# Altium project PDB.PrjPcb
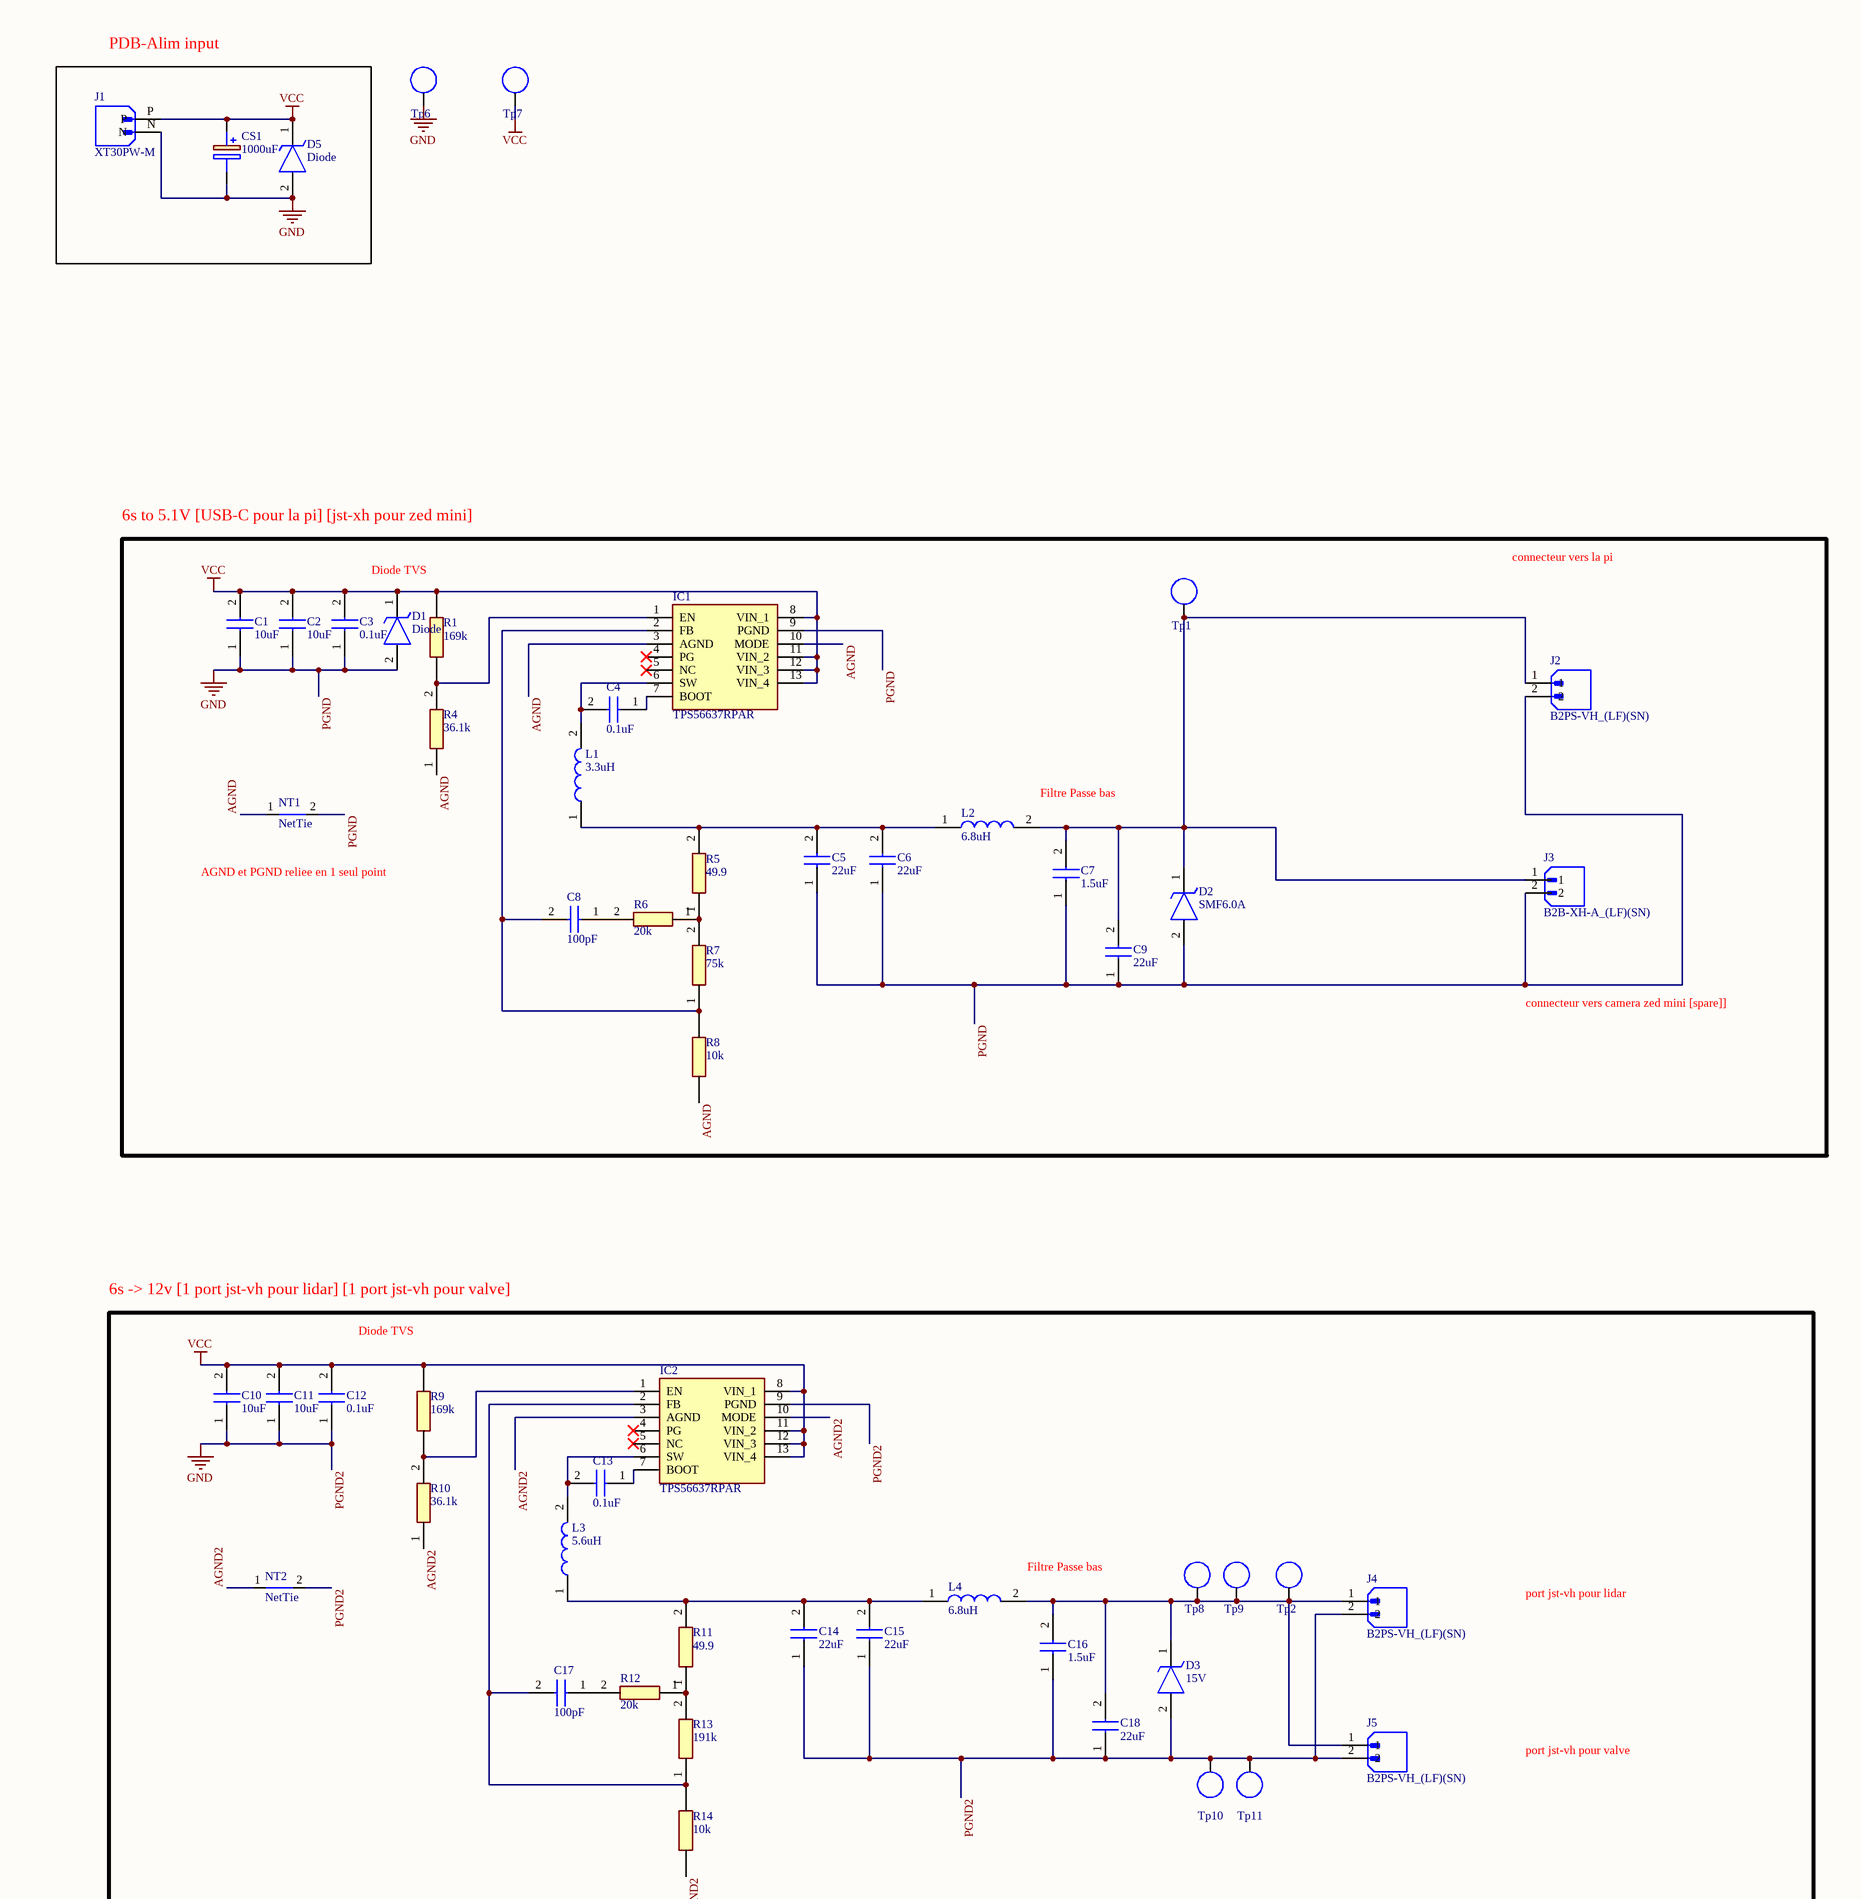
[diagram p0: PDB Schem.SchDoc, top]
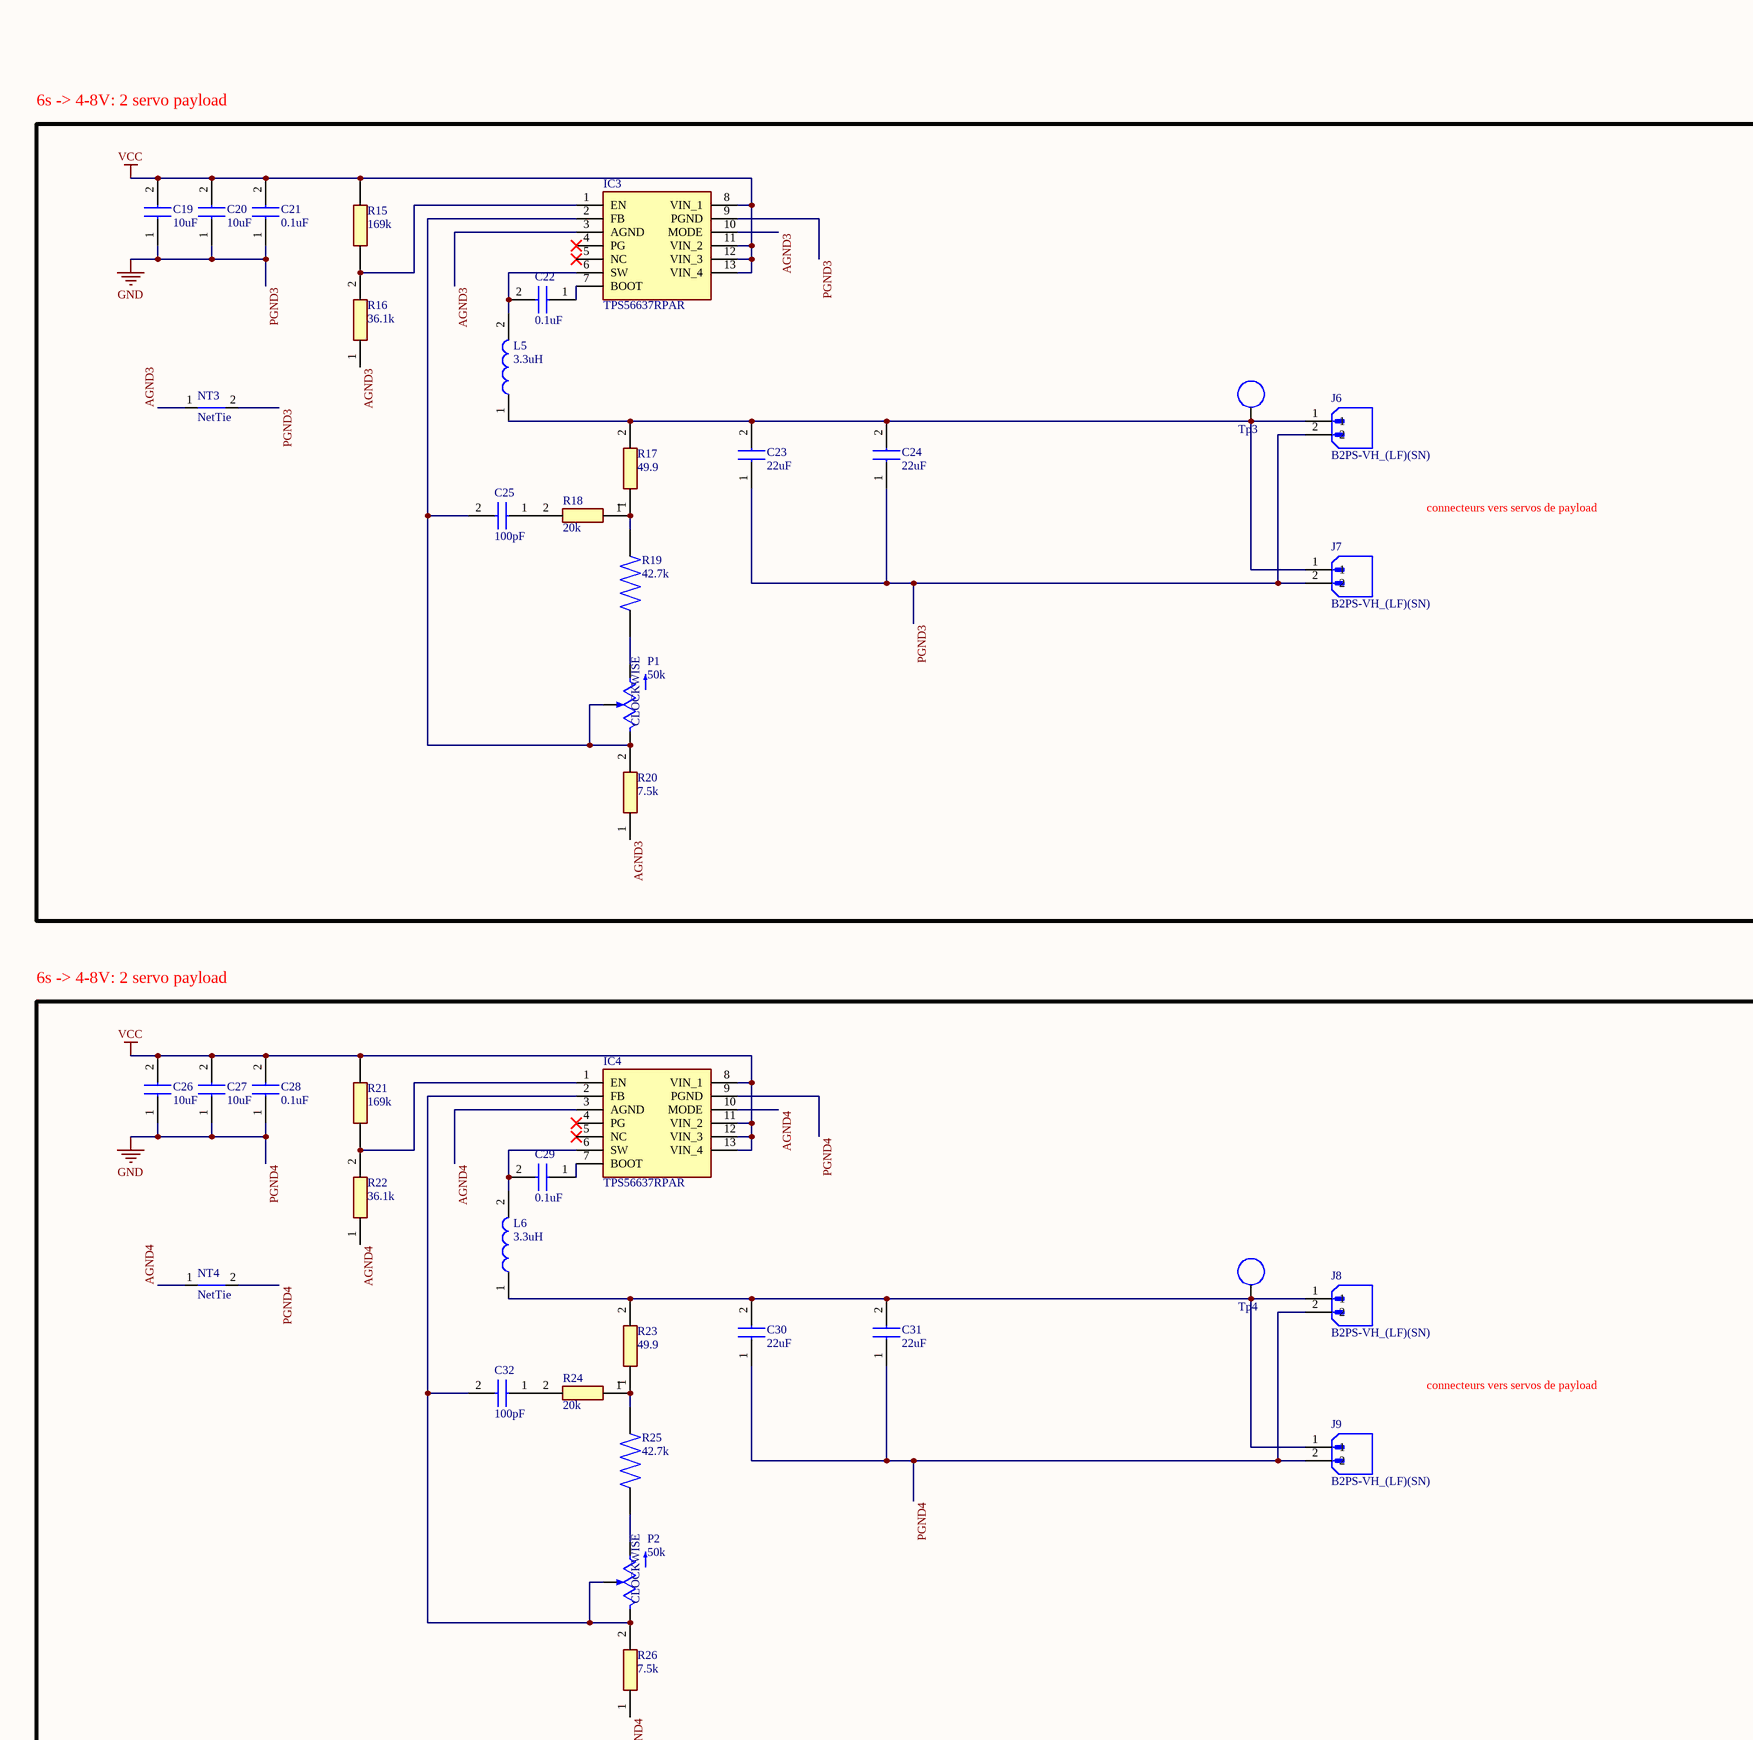
[diagram p1: PDB Schem.SchDoc, centre]
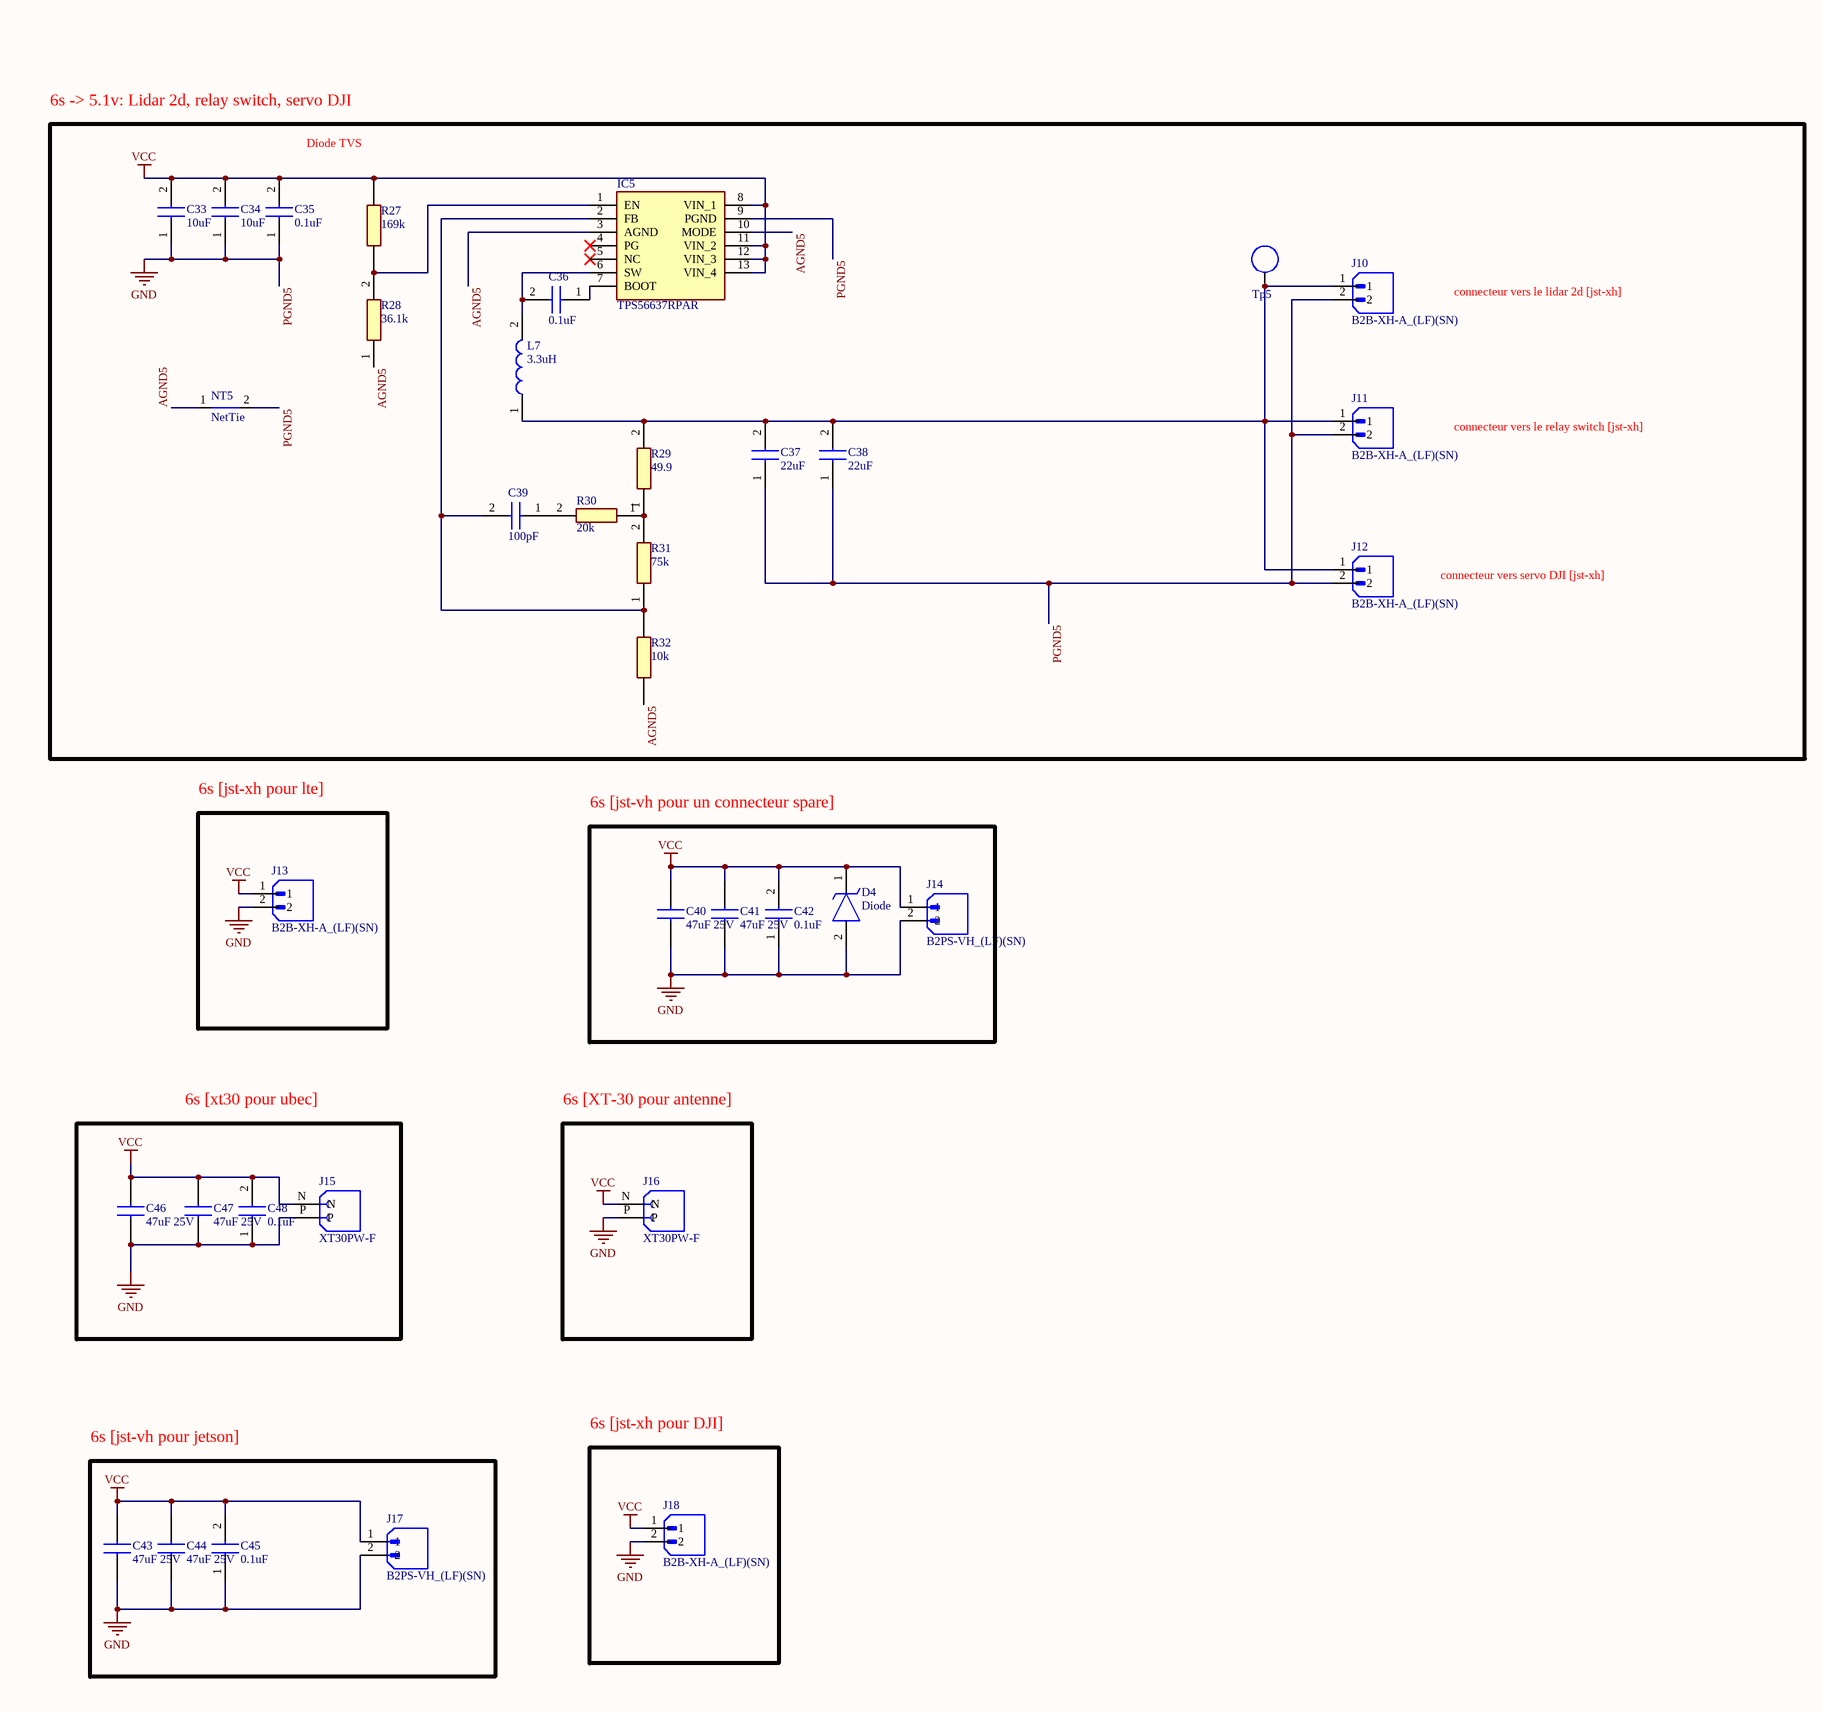
[diagram p2: PDB Schem.SchDoc, bottom]
1 sheet, 132 parts. Net scope: global (net labels, ports and power ports of the same name join across sheets).
Board file: PCB-PDB.PcbDoc

## Sheet PDB Schem.SchDoc
size 999 x 1499 mm; SheetNumber: 1; SheetTotal: 1

### Parts
C1  10uF  [CAPC3225X280N]
C2  10uF  [CAPC3225X280N]
C3  0.1uF  [C0603]
C4  0.1uF  [C0603]
C5  22uF  [CAPC2012X145N]
C6  22uF  [CAPC2012X145N]
C7  1.5uF  [CAPC3225X200N]
C8  100pF  [GRM1885C1H101JA01D]
C9  22uF  [CAPC2012X145N]
C10  10uF  [CAPC3225X280N]
C11  10uF  [CAPC3225X280N]
C12  0.1uF  [C0603]
C13  0.1uF  [C0603]
C14  22uF  [CAPC2012X145N]
C15  22uF  [CAPC2012X145N]
C16  1.5uF  [CAPC3225X200N]
C17  100pF  [GRM1885C1H101JA01D]
C18  22uF  [CAPC2012X145N]
C19  10uF  [CAPC3225X280N]
C20  10uF  [CAPC3225X280N]
C21  0.1uF  [C0603]
C22  0.1uF  [C0603]
C23  22uF  [CAPC2012X145N]
C24  22uF  [CAPC2012X145N]
C25  100pF  [GRM1885C1H101JA01D]
C26  10uF  [CAPC3225X280N]
C27  10uF  [CAPC3225X280N]
C28  0.1uF  [C0603]
C29  0.1uF  [C0603]
C30  22uF  [CAPC2012X145N]
C31  22uF  [CAPC2012X145N]
C32  100pF  [GRM1885C1H101JA01D]
C33  10uF  [CAPC3225X280N]
C34  10uF  [CAPC3225X280N]
C35  0.1uF  [C0603]
C36  0.1uF  [C0603]
C37  22uF  [CAPC2012X145N]
C38  22uF  [CAPC2012X145N]
C39  100pF  [GRM1885C1H101JA01D]
C40  47uF 25V  [CAPC3216X180N]
C41  47uF 25V  [CAPC3216X180N]
C42  0.1uF  [C0603]
C43  47uF 25V  [CAPC3216X180N]
C44  47uF 25V  [CAPC3216X180N]
C45  0.1uF  [C0603]
C46  47uF 25V  [CAPC3216X180N]
C47  47uF 25V  [CAPC3216X180N]
C48  0.1uF  [C0603]
CS1  1000uF  [CAPPRD500W60D1025H2150]
D1  Diode  [DIOM5436X244N]
D2  SMF6.0A  [SODFL3718X140N]
D3  15V  [DIOM5436X244N]
D4  Diode  [DIOM5436X244N]
D5  Diode  [DIOM5436X244N]
IC1  TPS56637RPAR  [TPS56637RPAR]
IC2  TPS56637RPAR  [TPS56637RPAR]
IC3  TPS56637RPAR  [TPS56637RPAR]
IC4  TPS56637RPAR  [TPS56637RPAR]
IC5  TPS56637RPAR  [TPS56637RPAR]
J1  XT30PW-M  [AMASS_XT30PW-M]
J2  B2PS-VH_(LF)(SN)  [JST_B2PS-VH_(LF)(SN)]
J3  B2B-XH-A_(LF)(SN)  [JST_B2B-XH-A_(LF)(SN)]
J4  B2PS-VH_(LF)(SN)  [JST_B2PS-VH_(LF)(SN)]
J5  B2PS-VH_(LF)(SN)  [JST_B2PS-VH_(LF)(SN)]
J6  B2PS-VH_(LF)(SN)  [JST_B2PS-VH_(LF)(SN)]
J7  B2PS-VH_(LF)(SN)  [JST_B2PS-VH_(LF)(SN)]
J8  B2PS-VH_(LF)(SN)  [JST_B2PS-VH_(LF)(SN)]
J9  B2PS-VH_(LF)(SN)  [JST_B2PS-VH_(LF)(SN)]
J10  B2B-XH-A_(LF)(SN)  [JST_B2B-XH-A_(LF)(SN)]
J11  B2B-XH-A_(LF)(SN)  [JST_B2B-XH-A_(LF)(SN)]
J12  B2B-XH-A_(LF)(SN)  [JST_B2B-XH-A_(LF)(SN)]
J13  B2B-XH-A_(LF)(SN)  [JST_B2B-XH-A_(LF)(SN)]
J14  B2PS-VH_(LF)(SN)  [JST_B2PS-VH_(LF)(SN)]
J15  XT30PW-F  [AMASS_XT30PW-F]
J16  XT30PW-F  [AMASS_XT30PW-F]
J17  B2PS-VH_(LF)(SN)  [JST_B2PS-VH_(LF)(SN)]
J18  B2B-XH-A_(LF)(SN)  [JST_B2B-XH-A_(LF)(SN)]
L1  3.3uH  [INDM3225X240N]
L2  6.8uH  [ASPIF60606R8MT]
L3  5.6uH  [INDPM125125X800N]
L4  6.8uH  [ASPIF60606R8MT]
L5  3.3uH  [INDM3225X240N]
L6  3.3uH  [INDM3225X240N]
L7  3.3uH  [INDM3225X240N]
NT1  NetTie  [NetTie]  (net tie, no BOM)
NT2  NetTie  [NetTie]  (net tie, no BOM)
NT3  NetTie  [NetTie]  (net tie, no BOM)
NT4  NetTie  [NetTie]  (net tie, no BOM)
NT5  NetTie  [NetTie]  (net tie, no BOM)
P1  50k  [TRIM_3361P-1-503GLF]
P2  50k  [TRIM_3361P-1-503GLF]
R1  169k  [RESC2012X50N]
R4  36.1k  [RESC1608X51N]
R5  49.9  [RESC3016X65N]
R6  20k  [RESC2012X60N]
R7  75k  [RESC3216X75N]
R8  10k  [RESC2012X60N]
R9  169k  [RESC2012X50N]
R10  36.1k  [RESC1608X51N]
R11  49.9  [RESC3016X65N]
R12  20k  [RESC2012X60N]
R13  191k  [ERJ6ENF1000V]
R14  10k  [RESC2012X60N]
R15  169k  [RESC2012X50N]
R16  36.1k  [RESC1608X51N]
R17  49.9  [RESC3016X65N]
R18  20k  [RESC2012X60N]
R19  42.7k  [RESC2012X60N]
R20  7.5k  [RESC1608X55N]
R21  169k  [RESC2012X50N]
R22  36.1k  [RESC1608X51N]
R23  49.9  [RESC3016X65N]
R24  20k  [RESC2012X60N]
R25  42.7k  [RESC2012X60N]
R26  7.5k  [RESC1608X55N]
R27  169k  [RESC2012X50N]
R28  36.1k  [RESC1608X51N]
R29  49.9  [RESC3016X65N]
R30  20k  [RESC2012X60N]
R31  75k  [RESC3216X75N]
R32  10k  [RESC2012X60N]
Tp1  Testpoint  [Testpoint]  (value not drawn)  (no BOM)
Tp2  Testpoint  [Testpoint]  (value not drawn)  (no BOM)
Tp3  Testpoint  [Testpoint]  (value not drawn)  (no BOM)
Tp4  Testpoint  [Testpoint]  (value not drawn)  (no BOM)
Tp5  Testpoint  [Testpoint]  (value not drawn)  (no BOM)
Tp6  Testpoint  [Testpoint]  (value not drawn)  (no BOM)
Tp7  Testpoint  [Testpoint]  (value not drawn)  (no BOM)
Tp8  Testpoint  [Testpoint]  (value not drawn)  (no BOM)
Tp9  Testpoint  [Testpoint]  (value not drawn)  (no BOM)
Tp10  Testpoint  [Testpoint]  (value not drawn)  (no BOM)
Tp11  Testpoint  [Testpoint]  (value not drawn)  (no BOM)

### Blocks framed on the sheet
PDB-Alim input: CS1 D5 J1
6s to 5.1V [USB-C pour la pi] [jst-xh pour zed mini]: C1-C9 D1 D2 IC1 J2 J3 L1 L2 NT1 R1 R4-R8 Tp1
6s -> 4-8V: 2 servo payload: C19-C25 IC3 J6 J7 L5 NT3 P1 R15-R20 Tp3
6s -> 4-8V: 2 servo payload: C26-C32 IC4 J8 J9 L6 NT4 P2 R21-R26 Tp4
6s -> 5.1v: Lidar 2d, relay switch, servo DJI: C33-C39 IC5 J10-J12 L7 NT5 R27-R32 Tp5
6s [jst-xh pour lte]: J13
6s [jst-vh pour un connecteur spare]: C40-C42 D4 J14
6s [xt30 pour ubec]: C46-C48 J15
6s [XT-30 pour antenne]: J16
6s [jst-vh pour jetson]: C43-C45 J17
6s [jst-xh pour DJI]: J18

### Nets
PGND: C1.1 C2.1 C3.1 C5.1 C6.1 C7.1 C9.1 C10.1 C11.1 C12.1 C14.1 C15.1 C16.1 C18.1 C19.1 C20.1 C21.1 C23.1 C24.1 C26.1 C27.1 C28.1 C30.1 C31.1 C33.1 C34.1 C35.1 C37.1 C38.1 C40.1 C41.1 C42.1 C43.1 C44.1 C45.1 C46.1 C47.1 C48.1 CS1.2(-) D1.2(A) D2.2(A) D3.2(A) D4.2(A) D5.2(A) IC1.9(PGND) IC2.9(PGND) IC3.9(PGND) IC4.9(PGND) IC5.9(PGND) J1.N J2.2 J3.2 J4.2 J5.2 J6.2 J7.2 J8.2 J9.2 J10.2 J11.2 J12.2 J13.2 J14.2 J15.P J16.P J17.2 J18.2 NT1.2 NT2.2 NT3.2 NT4.2 NT5.2 Tp6.TP Tp10.TP Tp11.TP  [also labelled GND, PGND2, PGND3, PGND4, PGND5]
VCC: C1.2 C2.2 C3.2 C10.2 C11.2 C12.2 C19.2 C20.2 C21.2 C26.2 C27.2 C28.2 C33.2 C34.2 C35.2 C40.2 C41.2 C42.2 C43.2 C44.2 C45.2 C46.2 C47.2 C48.2 CS1.1(+) D1.1(K) D4.1(K) D5.1(K) IC1.8(VIN_1) IC1.11(VIN_2) IC1.12(VIN_3) IC1.13(VIN_4) IC2.8(VIN_1) IC2.11(VIN_2) IC2.12(VIN_3) IC2.13(VIN_4) IC3.8(VIN_1) IC3.11(VIN_2) IC3.12(VIN_3) IC3.13(VIN_4) IC4.8(VIN_1) IC4.11(VIN_2) IC4.12(VIN_3) IC4.13(VIN_4) IC5.8(VIN_1) IC5.11(VIN_2) IC5.12(VIN_3) IC5.13(VIN_4) J1.P J13.1 J14.1 J15.N J16.N J17.1 J18.1 R1.2 R9.2 R15.2 R21.2 R27.2 Tp7.TP
AGND: IC1.3(AGND) IC1.10(MODE) NT1.1 R4.1 R8.1
AGND2: IC2.3(AGND) IC2.10(MODE) NT2.1 R10.1 R14.1
AGND3: IC3.3(AGND) IC3.10(MODE) NT3.1 R16.1 R20.1
AGND4: IC4.3(AGND) IC4.10(MODE) NT4.1 R22.1 R26.1
AGND5: IC5.3(AGND) IC5.10(MODE) NT5.1 R28.1 R32.1
NetC4_1: C4.1 IC1.7(BOOT)
NetC4_2: C4.2 IC1.6(SW) L1.2
NetC5_2: C5.2 C6.2 L1.1 L2.1 R5.2
NetC7_2: C7.2 C9.2 D2.1(K) J2.1 J3.1 L2.2 Tp1.TP
NetC8_1: C8.1 R6.2
NetC8_2: C8.2 IC1.2(FB) R7.1 R8.2
NetC13_1: C13.1 IC2.7(BOOT)
NetC13_2: C13.2 IC2.6(SW) L3.2
NetC14_2: C14.2 C15.2 L3.1 L4.1 R11.2
NetC16_2: C16.2 C18.2 D3.1(K) J4.1 J5.1 L4.2 Tp2.TP Tp8.TP Tp9.TP
NetC17_1: C17.1 R12.2
NetC17_2: C17.2 IC2.2(FB) R13.1 R14.2
NetC22_1: C22.1 IC3.7(BOOT)
NetC22_2: C22.2 IC3.6(SW) L5.2
NetC23_2: C23.2 C24.2 J6.1 J7.1 L5.1 R17.2 Tp3.TP
NetC25_1: C25.1 R18.2
NetC25_2: C25.2 IC3.2(FB) P1.1(CCW) P1.2(WIPER) R20.2
NetC29_1: C29.1 IC4.7(BOOT)
NetC29_2: C29.2 IC4.6(SW) L6.2
NetC30_2: C30.2 C31.2 J8.1 J9.1 L6.1 R23.2 Tp4.TP
NetC32_1: C32.1 R24.2
NetC32_2: C32.2 IC4.2(FB) P2.1(CCW) P2.2(WIPER) R26.2
NetC36_1: C36.1 IC5.7(BOOT)
NetC36_2: C36.2 IC5.6(SW) L7.2
NetC37_2: C37.2 C38.2 J10.1 J11.1 J12.1 L7.1 R29.2 Tp5.TP
NetC39_1: C39.1 R30.2
NetC39_2: C39.2 IC5.2(FB) R31.1 R32.2
NetIC1_1: IC1.1(EN) R1.1 R4.2
NetIC2_1: IC2.1(EN) R9.1 R10.2
NetIC3_1: IC3.1(EN) R15.1 R16.2
NetIC4_1: IC4.1(EN) R21.1 R22.2
NetIC5_1: IC5.1(EN) R27.1 R28.2
NetP1_3: P1.3(CW) R19.1
NetP2_3: P2.3(CW) R25.1
NetR5_1: R5.1 R6.1 R7.2
NetR11_1: R11.1 R12.1 R13.2
NetR17_1: R17.1 R18.1 R19.2
NetR23_1: R23.1 R24.1 R25.2
NetR29_1: R29.1 R30.1 R31.2

Not connected (* = marked no-connect by the designer): IC1 4(PG)* 5(NC)*; IC2 4(PG)* 5(NC)*; IC3 4(PG)* 5(NC)*; IC4 4(PG)* 5(NC)*; IC5 4(PG)* 5(NC)*

### Notes on the sheet
- Diode TVS
- connecteur vers la pi
- (near L2) Filtre Passe bas
- AGND et PGND reliee en 1 seul point
- connecteur vers camera zed mini [spare]]
- 6s -> 12v [1 port jst-vh pour lidar] [1 port jst-vh pour valve]
- (near L4) Filtre Passe bas
- port jst-vh pour lidar
- port jst-vh pour valve
- connecteurs vers servos de payload
- connecteur vers le lidar 2d [jst-xh]
- connecteur vers le relay switch [jst-xh]
- connecteur vers servo DJI [jst-xh]
- (in symbol TRIM_3361P-1-503GLF) CLOCKWISE

### Library data of the parts
C1 C2 C10 C11 C19 C20 C26 C27 C33 C34 = AGC1210X7R500-106KNE: Capacitor; Manufacturer_Name: Venkel; Datasheet Link: https://data.venkel.com/documents/agc-series?force=1; Height: 2.8mm; Manufacturer_Part_Number: AGC1210X7R500-106KNE
C3 C4 C12 C13 C21 C22 C28 C29 C35 C36 C42 C45 C48 = C0603C104K5RACTU: Capacitor; Manufacturer_Name: KEMET; Datasheet Link: https://content.kemet.com/datasheets/KEM_C1002_X7R_SMD.pdf; Height: 0.87mm; Manufacturer_Part_Number: C0603C104K5RACTU; Mouser Part Number: 80-C0603C104K5R; Mouser Price/Stock: https://www.mouser.co.uk/ProductDetail/KEMET/C0603C104K5RACTU?qs=l5k%252BbMnNDkkVcnZPSAaaiQ%3D%3D; Arrow Part Number: C0603C104K5RACTU; Arrow Price/Stock: https://www.arrow.com/en/products/c0603c104k5ractu/kemet-corporation?utm_currency=USD&region=nac
C5 C6 C9 C14 C15 C18 C23 C24 C30 C31 C37 C38 = C2012X5R1V226M125AC: Capacitor, 35V; Manufacturer_Name: TDK; Datasheet Link: https://product.tdk.com/info/en/catalog/datasheets/mlcc_commercial_midvoltage_en.pdf; Height: 1.45mm; Manufacturer_Part_Number: C2012X5R1V226M125AC; Mouser Part Number: 810-C2012X5R1V226MAC; Mouser Price/Stock: https://www.mouser.co.uk/ProductDetail/TDK/C2012X5R1V226M125AC?qs=6JAMGB%252BEdkyUk0d2Mu2IrQ%3D%3D; Arrow Part Number: C2012X5R1V226M125AC; Arrow Price/Stock: https://www.arrow.com/en/products/c2012x5r1v226m125ac/tdk?utm_currency=USD&region=nac
C7 C16 = C3225X7R2A155K200AB: Capacitor; Manufacturer_Name: TDK; Datasheet Link: https://product.tdk.com/info/en/catalog/datasheets/mlcc_commercial_midvoltage_en.pdf; Height: 2mm; Manufacturer_Part_Number: C3225X7R2A155K200AB; Mouser Part Number: 810-C3225X7R2A155K2B; Mouser Price/Stock: https://www.mouser.co.uk/ProductDetail/TDK/C3225X7R2A155K200AB?qs=xLDY6iXSiQYhBLhobQfC5A%3D%3D; Arrow Part Number: C3225X7R2A155K200AB; Arrow Price/Stock: https://www.arrow.com/en/products/c3225x7r2a155k200ab/tdk
C8 C17 C25 C32 C39 = GRM1885C1H101JA01D: Capacitor; Manufacturer_Name: Murata Electronics; Datasheet Link: https://search.murata.co.jp/Ceramy/image/img/A01X/G101/ENG/GRM1885C1H101JA01-01A.pdf; Height: 0.9mm; Manufacturer_Part_Number: GRM1885C1H101JA01D; Mouser Part Number: 81-GRM39C101J50; Mouser Price/Stock: https://www.mouser.co.uk/ProductDetail/Murata-Electronics/GRM1885C1H101JA01D?qs=H3lwsW1hsDt1I4guwPQ00A%3D%3D; Arrow Part Number: GRM1885C1H101JA01D; Arrow Price/Stock: https://www.arrow.com/en/products/grm1885c1h101ja01d/murata-manufacturing?utm_currency=USD&region=europe
C40 C41 C43 C44 C46 C47 = C3216X5R1E476M160AC: Capacitor 47 uF; Manufacturer_Name: TDK; Manufacturer_Part_Number: C3216X5R1E476M160AC.; Datasheet Link: https://media.digikey.com/pdf/Data%20Sheets/TDK%20PDFs/mlcc_commercial_general_Rev2018.pdf; Height: 1.8mm; Mouser Part Number: N/A; Mouser Price/Stock: https://www.mouser.com/Search/Refine.aspx?Keyword=N%2FA
CS1 = 35PX1000MEFC10X20: Capacitor Polarised; Manufacturer_Name: Rubycon; Datasheet Link: https://www.rubycon.co.jp/wp-content/uploads/catalog-aluminum/PX.pdf; Height: 21.5mm; Manufacturer_Part_Number: 35PX1000MEFC10X20; Mouser Part Number: 232-35PX1000MEFC10X2; Mouser Price/Stock: https://www.mouser.co.uk/ProductDetail/Rubycon/35PX1000MEFC10X20?qs=T3oQrply3y86%2F1qnNfO%252BAA%3D%3D; Arrow Part Number: 35PX1000MEFC10X20; Arrow Price/Stock: https://www.arrow.com/en/products/35px1000mefc10x20/rubycon?region=nac
D1 D4 D5 = SMBJ26A: TVS Diode (Uni-directional); Manufacturer_Name: Bourns; Datasheet Link: https://www.bourns.com/docs/product-datasheets/smbj.pdf?sfvrsn=34552159_17; Height: 2.44mm; Manufacturer_Part_Number: SMBJ26A; Mouser Part Number: 652-SMBJ26A; Mouser Price/Stock: https://www.mouser.co.uk/ProductDetail/Bourns/SMBJ26A?qs=%252Bf8Cd6aE5bzyuNXx4QjGJA%3D%3D; Arrow Part Number: SMBJ26A; Arrow Price/Stock: https://www.arrow.com/en/products/smbj26a/bourns?utm_currency=USD&region=nac
D2 = SMF6.0A: TVS Diode (Uni-directional); Manufacturer_Name: Diotec; Datasheet Link: https://www.mouser.cn/ProductDetail/Diotec-Semiconductor/SMF6.0A?qs=OlC7AqGiEDnWjoz6bXl5LA%3D%3D; Height: 1.4mm; Manufacturer_Part_Number: SMF6.0A; Mouser Part Number: 637-SMF6.0A; Mouser Price/Stock: https://www.mouser.co.uk/ProductDetail/Diotec-Semiconductor/SMF6.0A?qs=OlC7AqGiEDnWjoz6bXl5LA%3D%3D; Arrow Part Number: SMF6.0A; Arrow Price/Stock: https://www.arrow.com/en/products/smf6.0a/diotec-semiconductor-ag?utm_currency=USD&region=nac
D3 = SMBJ15A: TVS Diode (Uni-directional); Manufacturer_Name: Vishay; Datasheet Link: http://www.vishay.com/docs/88392/smbj.pdf; Height: 2.44mm; Manufacturer_Part_Number: SMBJ15A; Mouser Part Number: 78-SMBJ15A; Mouser Price/Stock: https://www.mouser.co.uk/ProductDetail/Vishay-General-Semiconductor/SMBJ15A?qs=%252BA9HMDDz5KavBY56EO7ceQ%3D%3D
IC1-IC5 = TPS56637RPAR: Integrated Circuit; Manufacturer_Name: Texas Instruments; Datasheet Link: https://www.ti.com/lit/gpn/TPS56637; Height: 1mm; Manufacturer_Part_Number: TPS56637RPAR; Mouser Part Number: 595-TPS56637RPAR; Mouser Price/Stock: https://www.mouser.co.uk/ProductDetail/Texas-Instruments/TPS56637RPAR?qs=9r4v7xj2LnkQ0Y9HL0qmSA%3D%3D; Arrow Part Number: TPS56637RPAR; Arrow Price/Stock: https://www.arrow.com/en/products/tps56637rpar/texas-instruments?utm_currency=USD&region=nac
J1 = XT30PW-M: Socket; DC supply; XT30; male; PIN: 2; on PCBs; THT; Colour: yellow; MF: AMASS; SnapEDA_Link: https://www.snapeda.com/parts/XT30PW-M/AMASS/view-part/?ref=snap; Package: None; Value: *; MP: XT30PW-M; Check_prices: https://www.snapeda.com/parts/XT30PW-M/AMASS/view-part/?ref=eda
J2 J4-J9 J14 J17 = B2PS-VH_(LF)(SN): Connector Header Through Hole, Right Angle 2 position 0.156 (3.96mm); MF: JST; MP: B2PS-VH (LF)(SN); SnapEDA_Link: https://www.snapeda.com/parts/B2PS-VH%20(LF)(SN)/JST/view-part/?ref=snap; Package: None; Value: *; Check_prices: https://www.snapeda.com/parts/B2PS-VH%20(LF)(SN)/JST/view-part/?ref=eda
J3 J10-J13 J18 = B2B-XH-A_(LF)(SN): Connector Header Through Hole 2 position 0.098 (2.50mm); MF: JST Sales; MP: B2B-XH-A (LF)(SN); SnapEDA_Link: https://www.snapeda.com/parts/B2B-XH-A%20(LF)(SN)/JST+Sales+America+Inc./view-part/?ref=snap; Package: None; Value: *; Check_prices: https://www.snapeda.com/parts/B2B-XH-A%20(LF)(SN)/JST+Sales+America+Inc./view-part/?ref=eda
J15 J16 = XT30PW-F: Socket; DC supply; XT30; female; PIN: 2; on PCBs; THT; yellow; 15A; MF: amass; SnapEDA_Link: https://www.snapeda.com/parts/XT30PW-F/AMASS/view-part/?ref=snap; Package: None; Value: *; MP: XT30PW-F; Check_prices: https://www.snapeda.com/parts/XT30PW-F/AMASS/view-part/?ref=eda
L1 L5-L7 = NLV32T-3R3J-EF: Inductor; Manufacturer_Name: TDK; Datasheet Link: https://product.tdk.com/system/files/dam/doc/product/inductor/inductor/smd/catalog/inductor_commercial_standard_nlv32-ef_en.pdf; Height: 2.4mm; Manufacturer_Part_Number: NLV32T-3R3J-EF
L2 L4 = ASPI-F6060-6R8M-T: Inductor; Manufacturer_Name: ABRACON; Datasheet Link: https://abracon.com/datasheets/ASPI-F6060.pdf; Height: 6mm; Manufacturer_Part_Number: ASPI-F6060-6R8M-T
L3 = SRR1280-5R6Y: Inductor; Manufacturer_Name: Bourns; Datasheet Link: https://docs.rs-online.com/c0b9/0900766b80ddd400.pdf; Height: 8mm; Manufacturer_Part_Number: SRR1280-5R6Y; Mouser Part Number: 652-SRR1280-5R6Y; Mouser Price/Stock: https://www.mouser.co.uk/ProductDetail/Bourns/SRR1280-5R6Y?qs=brMhP%2FMjUffYaqEo5zomkw%3D%3D
NT1-NT5 = NetTie: Net Tie
P1 P2 = TRIM_3361P-1-503GLF: Potentiometer 50k ohms; ComponentLink1Description: Manufacturer Link; ComponentLink1URL: https://www.digikey.ca/en/products/detail/bourns-inc/3361P-1-503GLF/1088375
R1 R9 R15 R21 R27 = CRCW08051K96FKEA: Resistor; Manufacturer_Name: Vishay; Datasheet Link: http://www.vishay.com/docs/20035/dcrcwe3.pdf; Height: 0.5mm; Manufacturer_Part_Number: CRCW08051K96FKEA; Mouser Part Number: 71-CRCW08051K96FKEA; Mouser Price/Stock: https://www.mouser.co.uk/ProductDetail/Vishay-Dale/CRCW08051K96FKEA?qs=1CkV0QOCgMpA%2F6GTgXIN%2Fg%3D%3D; Arrow Part Number: CRCW08051K96FKEA; Arrow Price/Stock: https://www.arrow.com/en/products/crcw08051k96fkea/vishay?region=nac
R4 R10 R16 R22 R28 = PTN0603E3612BST1: Resistor; Manufacturer_Name: Vishay; Datasheet Link: http://www.vishay.com/docs/60026/ptn.pdf; Height: 0.508mm; Manufacturer_Part_Number: PTN0603E3612BST1
R5 R11 R17 R23 R29 = RNCF1206TKY49R9: Resistor; Manufacturer_Name: Stackpole Electronics; Datasheet Link: https://www.seielect.com/catalog/sei-rncf.pdf; Height: 0.65mm; Manufacturer_Part_Number: RNCF1206TKY49R9; Mouser Part Number: 708-RNCF1206TKY49R9; Mouser Price/Stock: https://www.mouser.co.uk/ProductDetail/SEI-Stackpole/RNCF1206TKY49R9?qs=IPgv5n7u5QbrkyDMq71eTQ%3D%3D; Arrow Part Number: RNCF1206TKY49R9; Arrow Price/Stock: https://www.arrow.com/en/products/rncf1206tky49r9/stackpole-electronics?region=nac
R6 R12 R18 R24 R30 = RK73H2ATTD2002F: Resistor; Manufacturer_Name: KOA Speer; Datasheet Link: http://www.koaspeer.com/catimages/Products/RK73H/RK73H.pdf; Height: 0.6mm; Manufacturer_Part_Number: RK73H2ATTD2002F; Mouser Part Number: 660-RK73H2ATTD2002F; Mouser Price/Stock: https://www.mouser.com/Search/Refine.aspx?Keyword=660-RK73H2ATTD2002F
R7 R31 = CR1206-FX-7502ELF: Resistor; Manufacturer_Name: Bourns; Datasheet Link: http://www.bourns.com/data/global/pdfs/CHPREZTR.pdf; Height: 0.75mm; Manufacturer_Part_Number: CR1206-FX-7502ELF; Mouser Part Number: 652-CR1206FX-7502ELF; Mouser Price/Stock: https://www.mouser.co.uk/ProductDetail/Bourns/CR1206-FX-7502ELF?qs=x5wsLs3ZZ83CFlrcVX0CWw%3D%3D
R8 R14 R32 = CRCW080510K0FKEAHP: Resistor; Manufacturer_Name: Vishay; Datasheet Link: https://componentsearchengine.com/Datasheets/1/CRCW08051R00FKEAHP.pdf; Height: 0.6mm; Manufacturer_Part_Number: CRCW080510K0FKEAHP; Mouser Part Number: 71-CRCW080510K0FKEAH; Mouser Price/Stock: https://www.mouser.co.uk/ProductDetail/Vishay-Dale/CRCW080510K0FKEAHP?qs=FlFvgi4rxBybVOW6oiRQjA%3D%3D; Arrow Part Number: CRCW080510K0FKEAHP; Arrow Price/Stock: https://www.arrow.com/en/products/crcw080510k0fkeahp/vishay?utm_currency=USD&region=europe; ClassName: PowerModul
R13 = ERJ-6ENF1913V: Resistor; Manufacturer_Name: Panasonic; Datasheet Link: https://industrial.panasonic.com/cdbs/www-data/pdf/RDA0000/AOA0000C84.pdf; Height: 0.7mm; Manufacturer_Part_Number: ERJ-6ENF1913V; Mouser Part Number: 667-ERJ-6ENF1913V; Mouser Price/Stock: https://www.mouser.com/Search/Refine.aspx?Keyword=667-ERJ-6ENF1913V; Arrow Part Number: ERJ-6ENF1913V; Arrow Price/Stock: https://www.arrow.com/en/products/erj-6enf1913v/panasonic
R19 R25 = RN73R2ATTD4272D25: Package: None; Price: None; Value: *; MP: RN73R2ATTD4272D25; Availability: Unavailable
R20 R26 = RC0603FR-077K5L: Resistor; Manufacturer_Name: KEMET; Datasheet Link: http://www.yageo.com/documents/recent/PYu-RC0603_51_RoHS_L_v5.pdf; Height: 0.55mm; Manufacturer_Part_Number: RC0603FR-077K5L; Mouser Part Number: 603-RC0603FR-077K5L; Mouser Price/Stock: https://www.mouser.co.uk/ProductDetail/Yageo/RC0603FR-077K5L/?qs=2cAdsCoAWREF%252BylA0TXaCQ%3D%3D